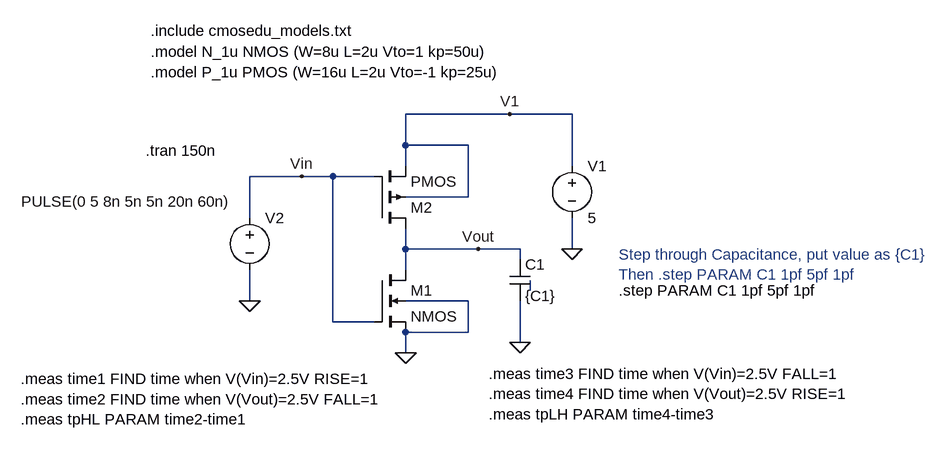
[diagram p0: schematic CMOS_Inv_PropDelay1.asc]
CMOS_Inv_PropDelay1.asc, the LTspice schematic file:
Version 4.1
SHEET 1 1028 680
WIRE 336 -80 176 -80
WIRE 432 -80 336 -80
WIRE 176 -32 176 -80
WIRE 272 -32 176 -32
WIRE 176 0 176 -32
WIRE 432 0 432 -80
WIRE 16 16 -64 16
WIRE 64 16 16 16
WIRE 128 16 64 16
WIRE 272 48 272 -32
WIRE 272 48 176 48
WIRE -64 80 -64 16
WIRE 176 128 176 96
WIRE 288 128 176 128
WIRE 352 128 288 128
WIRE 432 128 432 80
WIRE 352 144 352 128
WIRE 176 160 176 128
WIRE 368 192 368 176
WIRE -64 208 -64 160
WIRE 272 208 176 208
WIRE 64 240 64 16
WIRE 128 240 64 240
WIRE 272 256 272 208
WIRE 272 256 176 256
WIRE 352 272 352 208
WIRE 176 288 176 256
FLAG -64 208 0
FLAG 176 288 0
FLAG 432 128 0
FLAG 352 272 0
FLAG 16 16 Vin
FLAG 288 128 Vout
FLAG 336 -80 V1
SYMBOL nmos4 128 160 R0
SYMATTR InstName M1
SYMBOL pmos4 128 96 M180
SYMATTR InstName M2
SYMBOL voltage 432 -16 R0
WINDOW 123 0 0 Left 0
WINDOW 39 0 0 Left 0
SYMATTR InstName V1
SYMATTR Value 5
SYMBOL voltage -64 64 R0
WINDOW 3 -351 -9 Left 2
WINDOW 123 0 0 Left 0
WINDOW 39 0 0 Left 0
SYMATTR Value PULSE(0 5 8n 5n 5n 20n 60n)
SYMATTR InstName V2
SYMBOL cap 336 144 R0
SYMATTR InstName C1
SYMATTR Value {C1}
TEXT -216 -176 Left 2 !.model N_1u NMOS (W=8u L=2u Vto=1 kp=50u)\n.model P_1u PMOS (W=16u L=2u Vto=-1 kp=25u)
TEXT -224 -24 Left 2 !.tran 150n
TEXT -216 -208 Left 2 !.include cmosedu_models.txt
TEXT -416 328 Left 2 !.meas time1 FIND time when V(Vin)=2.5V RISE=1\n.meas time2 FIND time when V(Vout)=2.5V FALL=1\n.meas tpHL PARAM time2-time1
TEXT 304 320 Left 2 !.meas time3 FIND time when V(Vin)=2.5V FALL=1\n.meas time4 FIND time when V(Vout)=2.5V RISE=1\n.meas tpLH PARAM time4-time3
TEXT 504 136 Left 2 ;Step through Capacitance, put value as {C1}\nThen .step PARAM C1 1pf 5pf 1pf
TEXT 504 192 Left 2 !.step PARAM C1 1pf 5pf 1pf

The netlist it stands for:
* CMOS_Inv_PropDelay1.asc
M1 Vout Vin 0 0 NMOS
M2 Vout Vin V1 V1 PMOS
V1 V1 0 5
V2 Vin 0 PULSE(0 5 8n 5n 5n 20n 60n)
C1 Vout 0 {C1}
.model NMOS NMOS
.model PMOS PMOS
.lib standard.mos
.model N_1u NMOS (W=8u L=2u Vto=1 kp=50u)
.model P_1u PMOS (W=16u L=2u Vto=-1 kp=25u)
.tran 150n
.include cmosedu_models.txt
.meas time1 FIND time when V(Vin)=2.5V RISE=1
.meas time2 FIND time when V(Vout)=2.5V FALL=1
.meas tpHL PARAM time2-time1
.meas time3 FIND time when V(Vin)=2.5V FALL=1
.meas time4 FIND time when V(Vout)=2.5V RISE=1
.meas tpLH PARAM time4-time3
* Step through Capacitance, put value as {C1}
* Then .step PARAM C1 1pf 5pf 1pf
.step PARAM C1 1pf 5pf 1pf
.backanno
.end

* Results of the author's LTspice run, read from the files saved beside the schematic
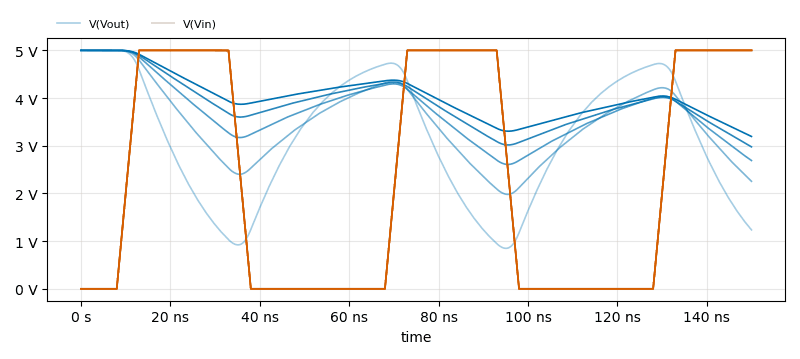
[diagram p1: Transient Analysis of CMOS_Inv_PropDelay1.asc, plotted from the saved traces]
* Transient Analysis, 5 runs:
*   V(Vout) [run 1]: min 848.4 mV, max 5 V, average 3.155 V, rms 3.424 V, last 1.235 V
*   V(Vout) [run 2]: min 1.98 V, max 5 V, average 3.485 V, rms 3.58 V, last 2.254 V
*   V(Vout) [run 3]: min 2.608 V, max 5 V, average 3.719 V, rms 3.773 V, last 2.69 V
*   V(Vout) [run 4]: min 2.977 V, max 5 V, average 3.894 V, rms 3.931 V, last 2.977 V
*   V(Vout) [run 5]: min 3.195 V, max 5 V, average 4.028 V, rms 4.056 V, last 3.195 V
*   V(Vin) [run 1]: min 0 V, max 5 V, average 2.317 V, rms 3.3 V, last 5 V
*   V(Vin) [run 2]: min 0 V, max 5 V, average 2.317 V, rms 3.3 V, last 5 V
*   V(Vin) [run 3]: min 0 V, max 5 V, average 2.317 V, rms 3.3 V, last 5 V
*   V(Vin) [run 4]: min 0 V, max 5 V, average 2.317 V, rms 3.3 V, last 5 V
*   V(Vin) [run 5]: min 0 V, max 5 V, average 2.317 V, rms 3.3 V, last 5 V